# Altium schematic sheet PG_V0.SchDoc
size 599 x 400 mm
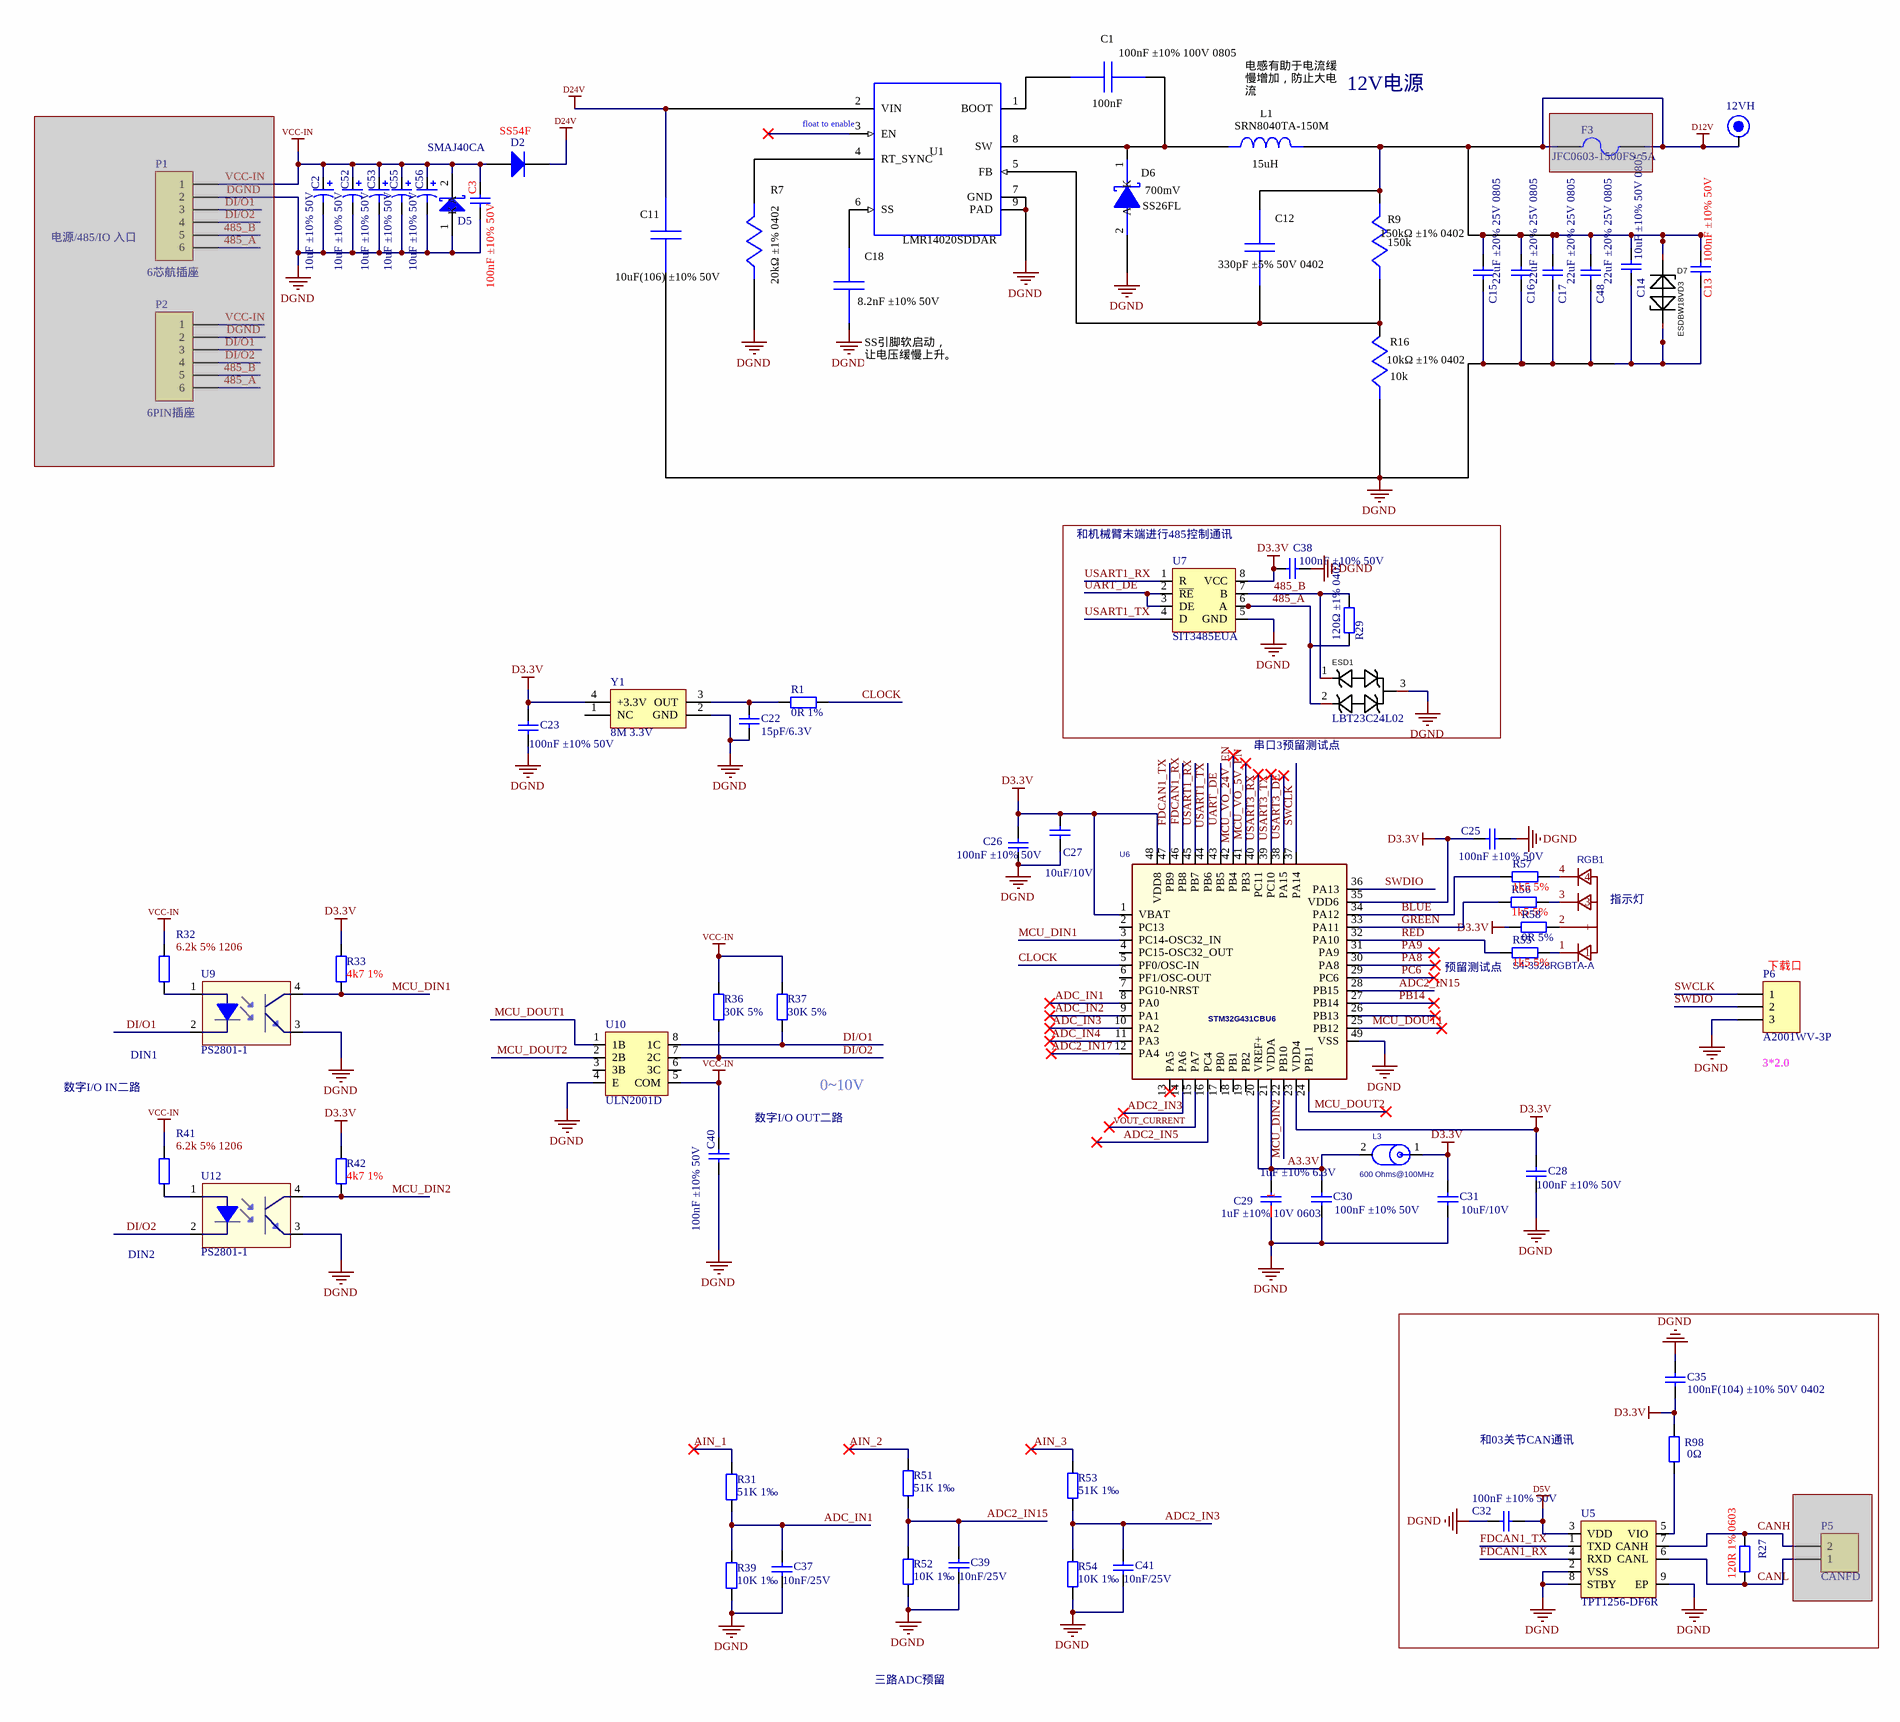
[diagram p0: PG_V0.SchDoc, left]
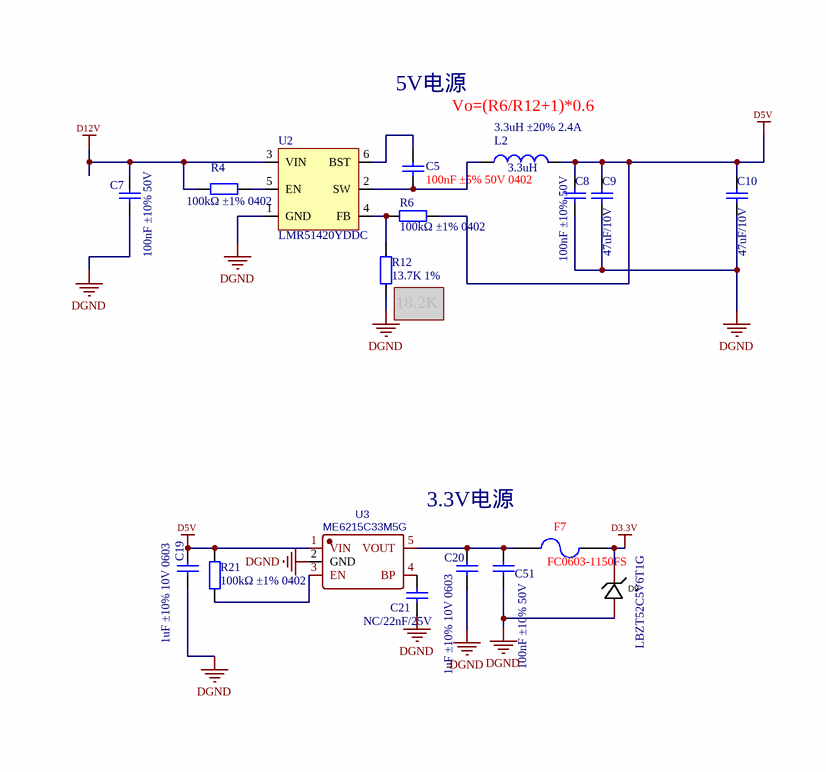
[diagram p1: PG_V0.SchDoc, right]

## Parts
12VH  Test point  [PAD07]  (value not drawn)
C1  100nF ±10% 100V 0805  value 100nF  [0805C]
C2  10uF ±10% 50V  [1206C]
C3  100nF ±10% 50V  [0402C]
C5  100nF ±5% 50V 0402  [0402C]
C7  100nF ±10% 50V  [0402C]
C8  100nF ±10% 50V  [0402C]
C9  47uF/10V  [0805C]
C10  47uF/10V  [0805C]
C11  10uF(106) ±10% 50V  [C1210]
C12  330pF ±5% 50V 0402  [0402C]
C13  100nF ±10% 50V  [0402C]
C14  10uF ±10% 50V 0805  [0805C]
C15  22uF ±20% 25V 0805  [0805C]
C16  22uF ±20% 25V 0805  [0805C]
C17  22uF ±20% 25V 0805  [0805C]
C18  8.2nF ±10% 50V  [0402C]
C19  1uF ±10% 10V 0603  [0603C]
C20  1uF ±10% 10V 0603  [0603C]
C21  NC/22nF/25V  [0402C]
C22  15pF/6.3V  [0402C]
C23  100nF ±10% 50V  [0402C]
C25  100nF ±10% 50V  [0402C]
C26  100nF ±10% 50V  [0402C]
C27  value 10uF/10V  [0603C]  (hidden comment: 10uF ±10% 10V 0603)
C28  100nF ±10% 50V  [0402C]
C29  1uF ±10% 6.3V  value 1uF ±10% 10V 0603  [0603C]
C30  100nF ±10% 50V  [0402C]
C31  value 10uF/10V  [0603C]  (hidden comment: 10uF ±10% 10V 0603)
C32  100nF ±10% 50V  [0402C]
C35  100nF(104) ±10% 50V 0402  [C0402-S]
C37  10nF/25V  [0402C]
C38  100nF ±10% 50V  [0402C]
C39  10nF/25V  [0402C]
C40  100nF ±10% 50V  [0402C]
C41  10nF/25V  [0402C]
C48  22uF ±20% 25V 0805  [0805C]
C51  100nF ±10% 50V  [0402C]
C52  10uF ±10% 50V  [1206C]
C53  10uF ±10% 50V  [1206C]
C55  10uF ±10% 50V  [1206C]
C56  10uF ±10% 50V  [1206C]
D2  SS54F  [SMA]
D5  SMAJ40CA  [SMA_L4.4-W2.8-LS5.1-BI]
D6  SS26FL  value 700mV  [SS26FL]
D7  ESDBW18VD3  [SOD-323A]
D9  LBZT52C5V6T1G  [SOD-123]
ESD1  LBT23C24L02  [SOT-23-3_L2.9-W1.3-P1.90-LS2.4-BR]
F3  JFC0603-1500FS  5A  [0603R]  (masked out: inside a compile mask, not in the netlist)
F7  FC0603-1150FS  [0603R]
L1  SRN8040TA-150M  value 15uH  [VLP8040]
L2  3.3uH ±20% 2.4A  value 3.3uH  [L4030]
L3  600 Ohms@100MHz  [0402R]
P1  6芯航插座  [HDR1X6]  (masked out: inside a compile mask, not in the netlist)
P2  6PIN插座  [HDR1X6]  (masked out: inside a compile mask, not in the netlist)
P5  CANFD  [PH2.0-WI-2P]  (masked out: inside a compile mask, not in the netlist)
P6  A2001WV-3P  [PH2.0_1X3S]
R1  0R 1%  [0402R]
R4  100kΩ ±1% 0402  [0402R]
R6  100kΩ ±1% 0402  [0402R]
R7  20kΩ ±1% 0402  [0402R]
R9  150kΩ ±1% 0402  value 150k  [0402R]
R12  13.7K 1%  [0402R]
R16  10kΩ ±1% 0402  value 10k  [0402R]
R21  100kΩ ±1% 0402  [0402R]
R27  120R 1% 0603  [0603R]
R29  120Ω ±1% 0402  [0402R]
R31  51K 1‰  [0402R]
R32  6.2k 5% 1206  [R1206]
R33  4k7 1%  [0402R]
R36  value 30K 5%  [0402R]  (hidden comment: 10kΩ ±1% 0402)
R37  value 30K 5%  [0402R]  (hidden comment: 10kΩ ±1% 0402)
R39  10K 1‰  [0402R]
R41  6.2k 5% 1206  [R1206]
R42  4k7 1%  [0402R]
R51  51K 1‰  [0402R]
R52  10K 1‰  [0402R]
R53  51K 1‰  [0402R]
R54  10K 1‰  [0402R]
R55  1k5 5%  [0402R]
R56  1k5 5%  [0402R]
R57  1k5 5%  [0402R]
R58  0R 5%  [0603R]
R98  0Ω  [R0402-S]
RGB1  S4-3528RGBTA-A  [LED_3528]
U1  LMR14020SDDAR  [LM4020]
U2  LMR51420YDDC  [TSOT23-6]
U3  ME6215C33M5G  [SOT-23-5_L3.0-W1.7-P0.95-LS2.8-BL]
U5  TPT1256-DF6R  [DFN8]
U6  STM32G431CBU6  [UFQFPN48]
U7  SIT3485EUA  [VSSOP8]
U9  PS2801-1  [SSOP4]
U10  ULN2001D  [SOIC8]
U12  PS2801-1  [SSOP4]
Y1  8M 3.3V  [XTAL_3225]

## Blocks framed on the sheet
和机械臂末端进行485控制通讯: C38 ESD1 R29 U7
和03关节CAN通讯: C32 C35 P5 R27 R98 U5

## Nets
D3.3V: C23.2 C25.2 C26.2 C27.2 C28.2 C31.2 C35.2 C38.2 D9.1(C) F7.2 L3.1 R33.2 R42.2 R58.2 R98.2 U6.1(VBAT) U6.23(VDD4) U6.35(VDD6) U6.48(VDD8) U7.8(VCC) Y1.4(+3.3V)
D5V: C8.1 C9.1 C10.1 C19.1 C32.1 L2.2 R6.2 R21.1 U3.1(VIN) U5.3(VDD)
D12V: 12VH.1 C7.1 C12.1 C13.1 C14.1 C15.1 C16.1 C17.1 C48.1 D7.1 L1.2 R4.1 R9.1 U2.3(VIN)
D24V: C11.1 D2.2(K) U1.2(VIN)
DGND: C2.2 C3.2 C7.2 C8.2 C9.2 C10.2 C11.2 C13.2 C14.2 C15.2 C16.2 C17.2 C18.2 C19.2 C20.2 C21.2 C22.1 C23.1 C25.1 C26.1 C27.1 C28.1 C29.1 C30.1 C31.1 C32.2 C35.1 C37.1 C38.1 C39.1 C40.2 C41.1 C48.2 C51.2 C52.2 C53.2 C55.2 C56.2 D5.1(A) D6.2(A) D7.2 D9.2(A) ESD1.3 P6.3 R7.2 R12.1 R16.2 R39.2 R52.2 R54.2 U1.7(GND) U1.9(PAD) U2.1(GND) U3.2(GND) U5.2(VSS) U5.8(STBY) U5.9(EP) U6.49(VSS) U7.5(GND) U9.3 U10.4(E) U12.3 Y1.2(GND)
VCC-IN: C2.1 C3.1 C40.1 C52.1 C53.1 C55.1 C56.1 D2.1(A) D5.2(K) R32.2 R36.1 R37.1 R41.2 U10.5(COM)
485_A: ESD1.2 R29.1 U7.6(A)
485_B: ESD1.1 R29.2 U7.7(B)
A3.3V: C29.2 C30.2 L3.2 U6.20(VREF+) U6.21(VDDA)
ADC2_IN3: C41.2 R53.2 R54.1 U6.14(PA6)
ADC2_IN5: U6.16(PC4)
ADC2_IN15: C39.2 R51.2 R52.1 U6.28(PB15)
ADC2_IN17: U6.12(PA4)
ADC_IN1: C37.2 R31.2 R39.1 U6.8(PA0)
ADC_IN2: U6.9(PA1)
ADC_IN3: U6.10(PA2)
ADC_IN4: U6.11(PA3)
AIN_1: R31.1
AIN_2: R51.1
AIN_3: R53.1
BLUE: R57.2 U6.34(PA12)
CANH: R27.2 U5.7(CANH)
CANL: R27.1 U5.6(CANL)
CLOCK: R1.1 U6.5(PF0/OSC-IN)
DI/O1: R37.2 U9.2 U10.8(1C)
DI/O2: R36.2 U10.7(2C) U12.2
FDCAN1_RX: U5.4(RXD) U6.46(PB8)
FDCAN1_TX: U5.1(TXD) U6.47(PB9)
GREEN: R56.2 U6.33(PA11)
MCU_DIN1: R33.1 U6.3(PC14-OSC32_IN) U9.4
MCU_DIN2: R42.1 U6.22(PB10) U12.4
MCU_DOUT1: U6.25(PB12) U10.1(1B)
MCU_DOUT2: U6.24(PB11) U10.2(2B)
MCU_VO_5V_EN: U6.41(PB3)
MCU_VO_24V_EN: U6.42(PB4)
PA8: U6.30(PA8)
PA9: U6.31(PA9)
PB14: U6.27(PB14)
PC6: U6.29(PC6)
RED: R55.2 U6.32(PA10)
SWCLK: P6.1 U6.37(PA14)
SWDIO: P6.2 U6.36(PA13)
UART_DE: U6.43(PB5) U7.2(~{RE}) U7.3(DE)
USART1_RX: U6.45(PB7) U7.1(R)
USART1_TX: U6.44(PB6) U7.4(D)
USART3_DE: U6.38(PA15)
USART3_RX: U6.40(PC11)
USART3_TX: U6.39(PC10)
VOUT_CURRENT: U6.15(PA7)
NetC1_1: C1.1 U1.1(BOOT)
NetC1_2: C1.2 D6.1(K) L1.1 U1.8(SW)
NetC5_1: C5.1 U2.6(BST)
NetC5_2: C5.2 L2.1 U2.2(SW)
NetC12_2: C12.2 R9.2 R16.1 U1.5(FB)
NetC18_1: C18.1 U1.6(SS)
NetC20_1: C20.1 C51.1 F7.1 U3.5(VOUT)
NetC21_1: C21.1 U3.4(BP)
NetC22_2: C22.2 R1.2 Y1.3(OUT)
NetR4_2: R4.2 U2.5(EN)
NetR6_1: R6.1 R12.2 U2.4(FB)
NetR7_1: R7.1 U1.4(RT_SYNC)
NetR21_2: R21.2 U3.3(EN)
NetR32_1: R32.1 U9.1
NetR41_1: R41.1 U12.1
NetR55_1: R55.1 RGB1.1
NetR56_1: R56.1 RGB1.3
NetR57_1: R57.1 RGB1.4
NetR58_1: R58.1 RGB1.2(+)
NetR98_1: R98.1 U5.5(VIO)

Not connected (* = marked no-connect by the designer): U1 3(EN)*; U6 2(PC13) 4(PC15-OSC32_OUT) 6(PF1/OSC-OUT) 7(PG10-NRST) 13(PA5)* 17(PB0) 18(PB1) 19(PB2) 26(PB13)*; U10 3(3B) 6(3C); Y1 1(NC)

## Notes on the sheet
- 12V电源
- 5V电源
- (near U1) float to enable
- (near L1) 电感有助于电流缓慢增加，防止大电流
- Vo=(R6/R12+1)*0.6
- 电源/485/IO 入口
- (near R12) 18.2K
- (near C18) SS引脚软启动，让电压缓慢上升。
- 3.3V电源
- (near ESD1) 串口3预留测试点
- (near RGB1) 指示灯
- 预留测试点
- (near P6) 下载口
- 数字I/O IN二路
- DIN1
- 0~10V
- (near P6) 3*2.0
- (near C40) 数字I/O OUT二路
- DIN2
- 三路ADC预留
- Title
- Size:
- Date:
- File:
- A2
- Number:
- Time:
- Revision:
- Sheet
- of

## Library data of the parts
12VH = TP: 测试点
C1 = C2012X7R2A104K125AA: C2012X7R2A104K12AA/100nF ±10% 100V 0805; Manufacturer Name: TDK; PackageReference: C2012X7R2A104K125AA; Manufacturer Part Number: C2012X7R2A104K125AA
C2 C52 C53 C55 C56 = Cap Pol1: GRM31CB31H106KA12L/10uF ±10% 50V 1206/（可选±20%替换）; Value: 100pF; Published: 8-Jun-2000; LatestRevisionDate: 17-Jul-2002; LatestRevisionNote: Re-released for DXP Platform.; PackageReference: RB7.6-15; Publisher: Altium Limited; PackageDescription: Polarized Capacitor (Radial); 2 Leads
C3 C7 C8 C13 C32 C40 C51 = Cap: C0402X7R104K500NT/100nF ±10% 50V 0402; Value: 100pF; Published: 8-Jun-2000; LatestRevisionDate: 17-Jul-2002; LatestRevisionNote: Re-released for DXP Platform.; PackageReference: RAD-0.3; Publisher: Altium Limited; PackageDescription: Radial Cap, Thru-Hole; 2 Leads; 0.3 in Pin Spacing
C5 = Cap: CC0402JRX7R8BB103//10nF ±5% 25V 0402; Value: 100pF; Published: 8-Jun-2000; LatestRevisionDate: 17-Jul-2002; LatestRevisionNote: Re-released for DXP Platform.; PackageReference: RAD-0.3; Publisher: Altium Limited; PackageDescription: Radial Cap, Thru-Hole; 2 Leads; 0.3 in Pin Spacing
C9 C10 C21 = Cap: Capacitor; Value: 100pF; Published: 8-Jun-2000; LatestRevisionDate: 17-Jul-2002; LatestRevisionNote: Re-released for DXP Platform.; PackageReference: RAD-0.3; Publisher: Altium Limited; PackageDescription: Radial Cap, Thru-Hole; 2 Leads; 0.3 in Pin Spacing
C11 = GRM32ER71J106KA12L: UMK325BJ106KM-P//10uF(106) ±10% 50V C1210; Manufacturer Name: MuRata; PackageReference: GRM32ER71J106KA12L; Manufacturer Part Number: GRM32ER71J106KA12L; Value: 10uF(106) ±10% 50V
C12 = GRM033R71E331KA01D: C1005NP0331JGT//330pF ±5% 50V 0402; Manufacturer Name: MuRata; PackageReference: GRM033R71E331KA01D; Manufacturer Part Number: GRM033R71E331KA01D; Value: 330pF
C14 = Cap: GRM21BR61H106KE43L; Value: 100pF; Published: 8-Jun-2000; LatestRevisionDate: 17-Jul-2002; LatestRevisionNote: Re-released for DXP Platform.; PackageReference: RAD-0.3; Publisher: Altium Limited; PackageDescription: Radial Cap, Thru-Hole; 2 Leads; 0.3 in Pin Spacing
C15-C17 C48 = Cap: CL21A226MAYNNNE; Value: 100pF; Published: 8-Jun-2000; LatestRevisionDate: 17-Jul-2002; LatestRevisionNote: Re-released for DXP Platform.; PackageReference: RAD-0.3; Publisher: Altium Limited; PackageDescription: Radial Cap, Thru-Hole; 2 Leads; 0.3 in Pin Spacing
C18 = GRM155R71C822KA01D: 0402B822K500CT//8.2nF ±10% 50V 0402//; Manufacturer Name: MuRata; PackageReference: GRM155R71C822KA01D; Manufacturer Part Number: GRM155R71C822KA01D; Value: 8.2nF
C19 C20 = Cap: CC0603KRX7R6BB105; Value: 100pF; Published: 8-Jun-2000; LatestRevisionDate: 17-Jul-2002; LatestRevisionNote: Re-released for DXP Platform.; PackageReference: RAD-0.3; Publisher: Altium Limited; PackageDescription: Radial Cap, Thru-Hole; 2 Leads; 0.3 in Pin Spacing
C22 C37 C39 C41 = Cap: Capacitor; Published: 8-Jun-2000; LatestRevisionDate: 17-Jul-2002; LatestRevisionNote: Re-released for DXP Platform.; PackageReference: RAD-0.3; Publisher: Altium Limited
  C22: Value: 15pF/6.3V
  C37 C39 C41: PackageDescription: Radial Cap, Thru-Hole; 2 Leads; 0.3 in Pin Spacing; Value: 10nF/25V
C23 = Cap: C0402X7R104K500NT/100nF ±10% 50V 0402; Value: 0.1uF/6.3V; Published: 8-Jun-2000; LatestRevisionDate: 17-Jul-2002; LatestRevisionNote: Re-released for DXP Platform.; PackageReference: RAD-0.3; Publisher: Altium Limited
C25 C26 C28 C30 C38 = Cap: C0402X7R104K500NT/100nF ±10% 50V 0402; Value: 0.1uF/10V; Published: 8-Jun-2000; LatestRevisionDate: 17-Jul-2002; LatestRevisionNote: Re-released for DXP Platform.; PackageReference: RAD-0.3; Publisher: Altium Limited; PackageDescription: Radial Cap, Thru-Hole; 2 Leads; 0.3 in Pin Spacing
C27 = Cap: 0603B103K100CT; Published: 8-Jun-2000; LatestRevisionDate: 17-Jul-2002; LatestRevisionNote: Re-released for DXP Platform.; PackageReference: RAD-0.3; Publisher: Altium Limited; PackageDescription: Radial Cap, Thru-Hole; 2 Leads; 0.3 in Pin Spacing
C29 = Cap: CC0402KRX7R5BB105; Published: 8-Jun-2000; LatestRevisionDate: 17-Jul-2002; LatestRevisionNote: Re-released for DXP Platform.; PackageReference: RAD-0.3; Publisher: Altium Limited; PackageDescription: Radial Cap, Thru-Hole; 2 Leads; 0.3 in Pin Spacing
C31 = Cap: 0603B103K100CT//10uF ±10% 10V 0603; Published: 8-Jun-2000; LatestRevisionDate: 17-Jul-2002; LatestRevisionNote: Re-released for DXP Platform.; PackageReference: RAD-0.3; Publisher: Altium Limited; PackageDescription: Radial Cap, Thru-Hole; 2 Leads; 0.3 in Pin Spacing
C35 = Cap: GRM155R71H104KE14D; Published: 8-Jun-2000; LatestRevisionDate: 17-Jul-2002; LatestRevisionNote: Re-released for DXP Platform.; PackageReference: RAD-0.3; Publisher: Altium Limited; PackageDescription: Radial Cap, Thru-Hole; 2 Leads; 0.3 in Pin Spacing
D2 = Diode 1N4148: 5A 40V  SMA; Published: 8-Jun-2000; LatestRevisionDate: 17-Jul-2002; LatestRevisionNote: Re-released for DXP Platform.; DatasheetVersion: 1997; PackageReference: DO-35; Publisher: Altium Limited; PackageDescription: Diode, Axial; Body 3.8 x 1.9 mm (LxDia. max), Lead Dia. 0.53 mm (max); Code_JEDEC: DO-204-AH; ComponentLink1Description: Manufacturer Link; ComponentLink1URL: http://www.fairchildsemi.com/; ComponentLink2Description: Datasheet; ComponentLink2URL: http://www.fairchildsemi.com/ds/1N%2F1N4148.pdf
D5 = DIODE-3: 双向TVS二极管
D6 = SS26FL: SS26FL  SMAF; Manufacturer Name: Fairchild Semiconductor; PackageReference: SS26FL; Manufacturer Part Number: SS26FL
D7 = PESD12VL1BA,115: Manufacturer: Nexperia(安世); Add into BOM: yes; polarity: 双向; Reverse Stand-Off Voltage (Vrwm): 12V; Maximum Clamping Voltage: 37V; Peak Pulse Current (Ipp)@10/1000us: 5A; Peak Pulse Power Dissipation (Ppp)@10/1000us: 200W; Breakdown Voltage: 14.2V; Number of Lines: 单路; Type: ESD; Symbol: PESD12VL1BA,115; Device: PESD12VL1BA,115; LCSC Part Name: 双向ESD; Supplier Part: C38558; Manufacturer Part: PESD12VL1BA,115; Supplier Footprint: SOD-323; JLCPCB Part Class: Extended Part; Datasheet: https://atta.szlcsc.com/upload/public/pdf/source/20170606/1496716521338.pdf; Supplier: LCSC; Convert to PCB: yes; Operating Temperature: -65℃~+150℃@(Ta)
D9 = LBZT52C5V6T1G: 稳压二极管反向使用; Manufacturer: LRC(乐山无线电); Add into BOM: yes; Diode Configuration: 独立式; Zener Voltage (Nom): 5.6V; Zener Voltage (Range): 5.2V~6V; Power Dissipation: 500mW; Reverse Leakage Current (Ir): 5mA; Zener Impedance (Zzt): 40Ω; Name: LBZT52C5V6T1G; Symbol: LBZT52C5V6T1G; Device: LBZT52C5V6T1G; LCSC Part Name: 齐纳二极管 5.6V 500mW; Supplier Part: C12770; Manufacturer Part: LBZT52C5V6T1G; Supplier Footprint: SOD-123; JLCPCB Part Class: Extended Part; Datasheet: https://atta.szlcsc.com/upload/public/pdf/source/20180228/C12770_15198052845211377127.pdf; Supplier: LCSC; Convert to PCB: yes; Tolerance: -
ESD1 = LBT23C24L02: Manufacturer: Brightking(君耀电子); Add into BOM: yes; Name: LBT23C24L02; Symbol: LBT23C24L02; Device: LBT23C24L02; LCSC Part Name: LBT23C24L02; Supplier Part: C523042; Manufacturer Part: LBT23C24L02; Supplier Footprint: SOT-23-3; JLCPCB Part Class: Extended Part; Datasheet: https://atta.szlcsc.com/upload/public/pdf/source/20200427/C523042_E04B1CCD74798A854320766B44FCE598.pdf; Supplier: LCSC; Convert to PCB: yes
F3 F7 = Fuse 2: Fuse 1.5A; Published: 8-Jun-2000; LatestRevisionDate: 17-Jul-2002; LatestRevisionNote: Re-released for DXP Platform.; PackageReference: PIN-W2/E2.8; Publisher: Altium Limited
L1 = SRU8043-100Y: SRN8040TA-150M  15uH  3.6A  50mΩ; Manufacturer Name: Bourns; PackageReference: SRU8043-100Y; Manufacturer Part Number: SRU8043-100Y
L2 = Inductor: SWPA4030S3R3MT; Code_IEC: 1005; Published: 8-Jun-2000; LatestRevisionDate: 29-May-2009; LatestRevisionNote: IPC-7351 Footprint Added.; PackageReference: 0402-A; Publisher: Altium Limited; PackageDescription: Chip Inductor; Code_JEITA: 0402
L3 = IND_FB: FERRITE BEAD 600 OHM 0402 1LN; Manufacturer PN: BLM15BX601SN1D; Manufacturer: Murata Electronics North America; PART_NUMBER: TMP-492; CLASS: DISCRETE; Package Size: 0402 (1005 Metric)
P1 P2 = Header 6: Header, 6-Pin; LatestRevisionDate: 17-Jul-2002; LatestRevisionNote: Re-released for DXP Platform.; Publisher: Altium Limited
P5 = Header 2: Header, 2-Pin; LatestRevisionDate: 17-Jul-2002; LatestRevisionNote: Re-released for DXP Platform.; Publisher: Altium Limited
P6 = Header 3: Header, 3-Pin; LatestRevisionDate: 17-Jul-2002; LatestRevisionNote: Re-released for DXP Platform.; Publisher: Altium Limited
R1 R31 R39 R51-R54 R98 = Res2: Resistor; Published: 8-Jun-2000; LatestRevisionDate: 17-Jul-2002; LatestRevisionNote: Re-released for DXP Platform.; Publisher: Altium Limited
  R1: Value: 0R 1%
  R31 R51 R53: Value: 51K 1‰
  R39 R52 R54: Value: 10K 1‰
  R98: PackageReference: AXIAL-0.4; Value: 0Ω
R4 = Res2: 0402WGF3902TCE; Value: 10K 5%; Published: 8-Jun-2000; LatestRevisionDate: 17-Jul-2002; LatestRevisionNote: Re-released for DXP Platform.; Publisher: Altium Limited
R6 = Res2: RTT021003FTH; Value: 10K 5%; Published: 8-Jun-2000; LatestRevisionDate: 17-Jul-2002; LatestRevisionNote: Re-released for DXP Platform.; Publisher: Altium Limited
R7 = CRCW040226K1FKED: AC0402FR-0720KL//20kΩ ±1% 0402; Manufacturer Name: Vishay-Dale; Value: 20k; PackageReference: CRCW040226K1FKED; Manufacturer Part Number: CRCW040226K1FKED
R9 = CRCW0402150KFKED: Manufacturer Name: Vishay-Dale; PackageReference: CRCW0402150KFKED; Manufacturer Part Number: CRCW0402150KFKED
R12 = Res2: 0402WGF1872TCE; Value: 31.6K 1%; Published: 8-Jun-2000; LatestRevisionDate: 17-Jul-2002; LatestRevisionNote: Re-released for DXP Platform.; Publisher: Altium Limited
R16 = RC0201FR-0710KL: Manufacturer Name: Yageo; PackageReference: RC0201FR-0710KL; Manufacturer Part Number: RC0201FR-0710KL
R21 = Res2: Resistor; Value: 10K 5%; Published: 8-Jun-2000; LatestRevisionDate: 17-Jul-2002; LatestRevisionNote: Re-released for DXP Platform.; Publisher: Altium Limited
R27 = Res2: RTT031200FTP//RC0603FR-07120RL; Value: 1K; Published: 8-Jun-2000; LatestRevisionDate: 17-Jul-2002; LatestRevisionNote: Re-released for DXP Platform.; PackageReference: AXIAL-0.4; Publisher: Altium Limited; PackageDescription: Axial Device, Thru-Hole; 2 Leads; 0.4 in Pin Spacing
R29 = Res2: RC0402FR-07120RL; Value: 1K; Published: 8-Jun-2000; LatestRevisionDate: 17-Jul-2002; LatestRevisionNote: Re-released for DXP Platform.; PackageReference: AXIAL-0.4; Publisher: Altium Limited; PackageDescription: Axial Device, Thru-Hole; 2 Leads; 0.4 in Pin Spacing
R32 R33 R41 R42 R55-R57 = Res2: Resistor; Value: 1K; Published: 8-Jun-2000; LatestRevisionDate: 17-Jul-2002; LatestRevisionNote: Re-released for DXP Platform.; PackageReference: AXIAL-0.4; Publisher: Altium Limited; PackageDescription: Axial Device, Thru-Hole; 2 Leads; 0.4 in Pin Spacing
R36 R37 = Res2: RC0201FR-0710KL; Published: 8-Jun-2000; LatestRevisionDate: 17-Jul-2002; LatestRevisionNote: Re-released for DXP Platform.; Publisher: Altium Limited
R58 = Res2: 0603; Value: 1K; Published: 8-Jun-2000; LatestRevisionDate: 17-Jul-2002; LatestRevisionNote: Re-released for DXP Platform.; PackageReference: AXIAL-0.4; Publisher: Altium Limited; PackageDescription: Axial Device, Thru-Hole; 2 Leads; 0.4 in Pin Spacing
RGB1 = TJ-L5FYTXHTCYLCRGB-A5: BOM_Manufacturer: TOGIALED; Contributor: LCSC; BOM_Supplier: LCSC; BOM_Supplier Part: C330749; BOM_Manufacturer Part: TJ-L5FYTXHTCYLCRGB-A5; BOM_JLCPCB Part Class: Extended Part; spicePre: L; spiceSymbolName: TJ-L5FYTXHTCYLCRGB-A5
U1 = LMR14020SDDAR: LMR14020SDDAR / DC-DC电源芯片//SO PowerPAD-8; Manufacturer Name: Texas Instruments; PackageReference: LMR14020SDDAR; Manufacturer Part Number: LMR14020SDDAR; Value: N/A
U2 = SCT2220TVB: LMR51420YDDC  SOT23-6
U3 = SSP9193-33M5R: ME6215C33M5G  SOT23-5; BOM_Manufacturer: Shanghai Siproin Microelectronics; Contributor: LCSC; BOM_Supplier: LCSC; BOM_Supplier Part: C411022; BOM_Manufacturer Part: SSP9193-33M5R; BOM_JLCPCB Part Class: Extended Part; spicePre: U; spiceSymbolName: SSP9193-33M5R
U5 = MCP2562FDT-E/MF: MCP2562FDT-E/MF  DFN-8
U6 = STM32_LQFP64_6: STM32G431CBU6  QFN48
U7 = THVD1450
U9 U12 = PS2801-1: 光耦 PS2801-1 SOP-4
U10 = ULN2001D: ULN2001D SOP-8
Y1 = XTLA_Sc: Value: 8M 3.3V